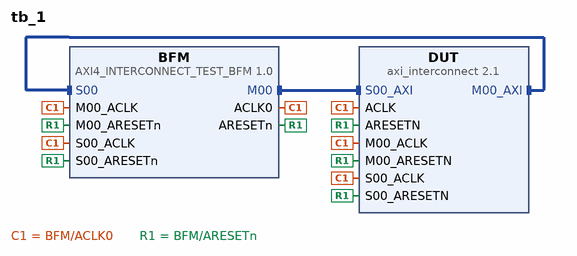
[diagram p0: block diagram of the top level]
# Vivado block design tb_1, Vivado 2013.4
create_bd_design tb_1

create_bd_cell -type ip -vlnv ikwzm:Dummy_Plug:AXI4_INTERCONNECT_TEST_BFM:1.0 BFM
set_property -dict {CONFIG.M00_DATA_WIDTH 512 CONFIG.SCENARIO_FILE ../../../ip/bfm/src/scenarios/test.snr} [get_bd_cells BFM]
create_bd_cell -type ip -vlnv xilinx.com:ip:axi_interconnect:2.1 DUT
set_property -dict {CONFIG.NUM_MI 1 CONFIG.ENABLE_ADVANCED_OPTIONS 1} [get_bd_cells DUT]

# ---- connections ----

connect_bd_intf_net [get_bd_intf_pins DUT/M00_AXI] [get_bd_intf_pins BFM/S00]
connect_bd_intf_net [get_bd_intf_pins BFM/M00] [get_bd_intf_pins DUT/S00_AXI]
connect_bd_net [get_bd_pins BFM/ACLK0] \
  [get_bd_pins BFM/M00_ACLK] [get_bd_pins BFM/S00_ACLK] [get_bd_pins DUT/ACLK] [get_bd_pins DUT/S00_ACLK] \
  [get_bd_pins DUT/M00_ACLK]
connect_bd_net [get_bd_pins BFM/ARESETn] \
  [get_bd_pins BFM/M00_ARESETn] [get_bd_pins BFM/S00_ARESETn] [get_bd_pins DUT/M00_ARESETN] [get_bd_pins DUT/S00_ARESETN] \
  [get_bd_pins DUT/ARESETN]

# ---- address map ----
assign_bd_address -offset 0x00000000 -range 4G -target_address_space [get_bd_addr_spaces BFM/M00] [get_bd_addr_segs BFM/S00/S00]

validate_bd_design
save_bd_design
